# EAGLE design centerplates (EAGLE 5.07)
GROUP: openmulticopter.org; LICENSE: CC-BY-SA 3.0; PROJECT_NAME: omc centerplates; REV: v0.1
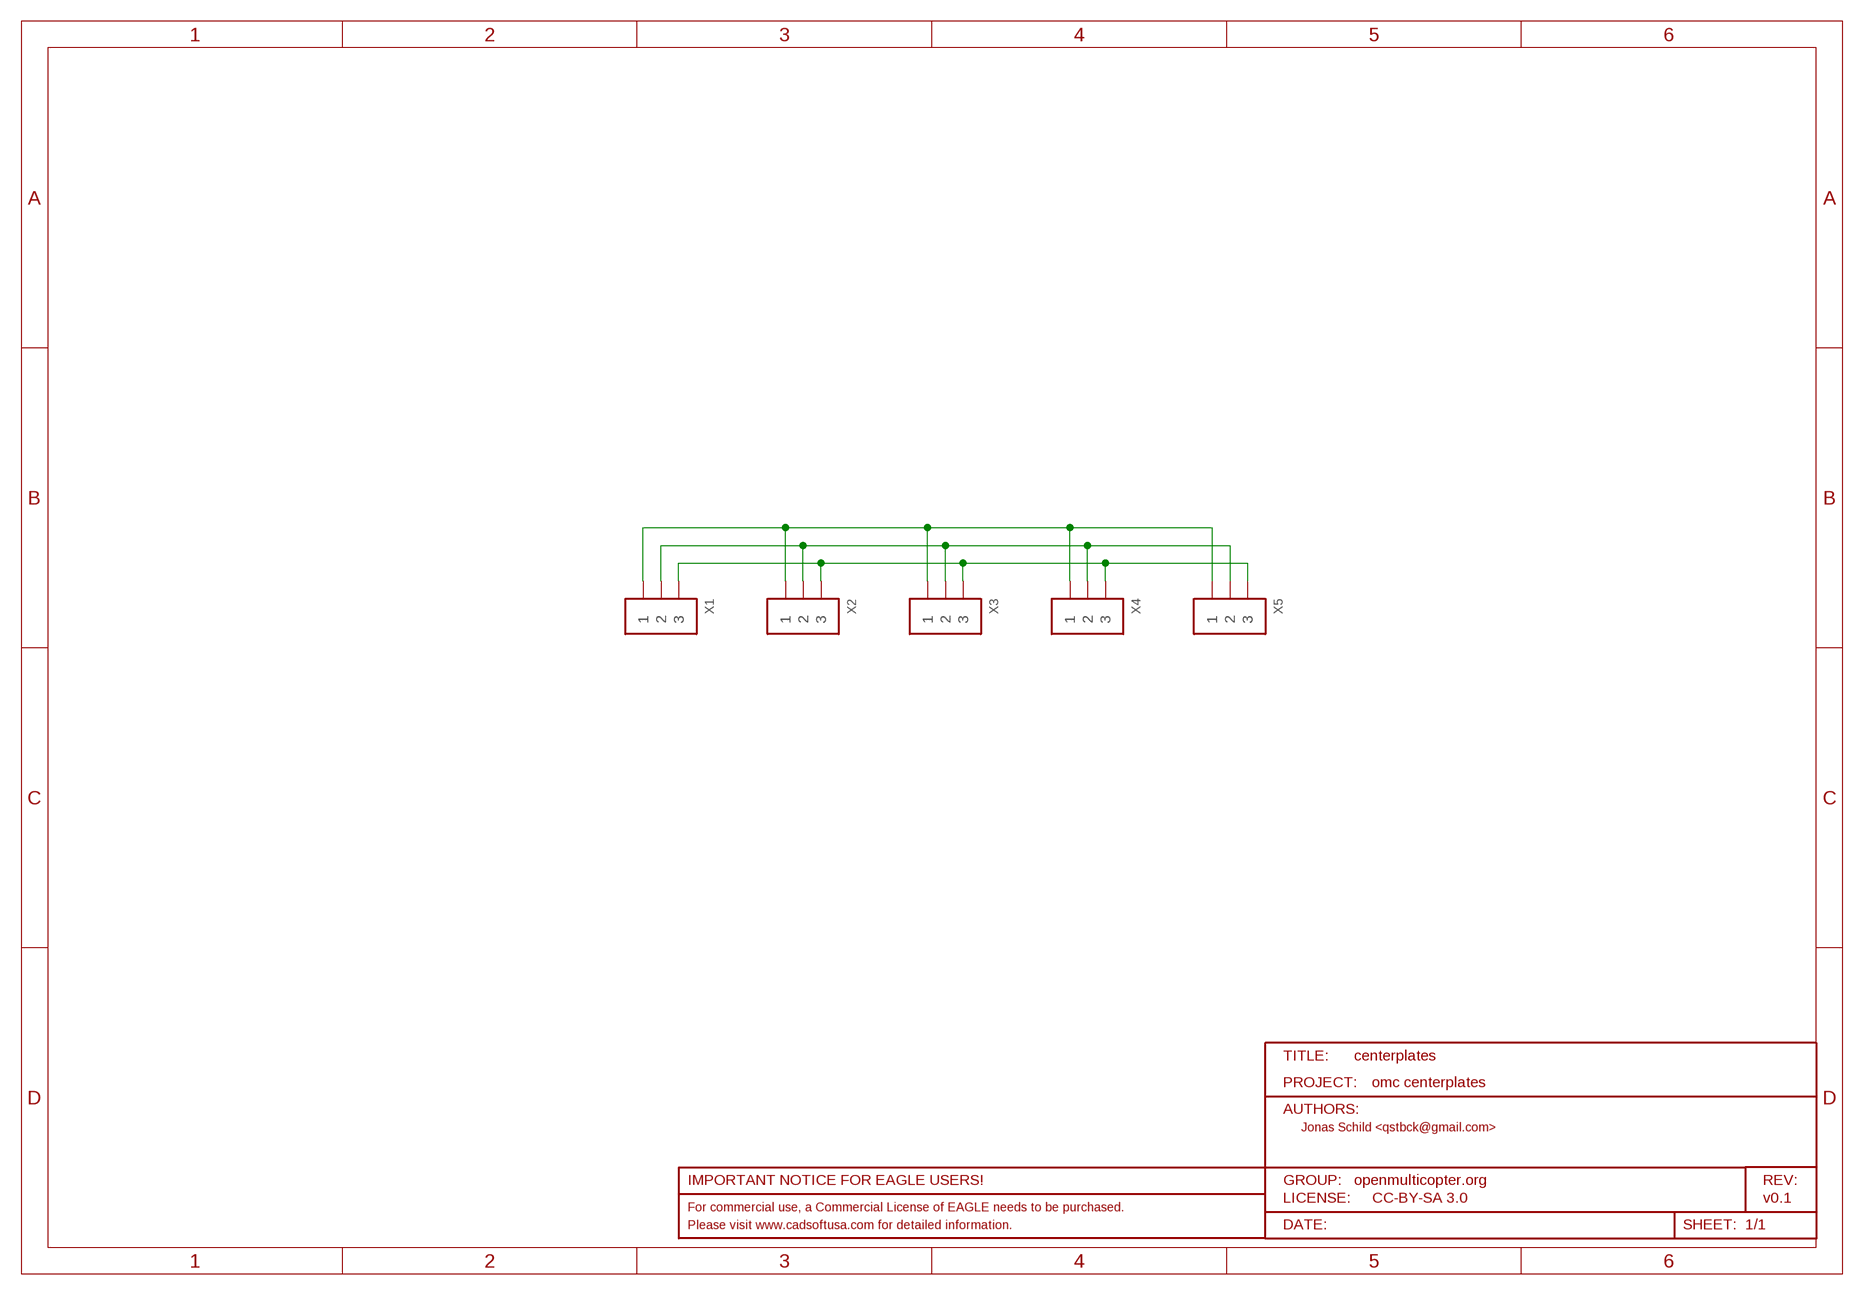
[diagram p0: schematic, sheet 1]

## Parts
X1  CONN_3-1-53261  [PB-53261-03]
X2  CONN_3-1-53261  [PB-53261-03]
X3  CONN_3-1-53261  [PB-53261-03]
X4  CONN_3-1-53261  [PB-53261-03]
X5  CONN_3-1-53261  [PB-53261-03]

## Nets
N$1: X1.1 X2.1 X3.1 X4.1 X5.1
N$2: X1.2 X2.2 X3.2 X4.2 X5.2
N$3: X1.3 X2.3 X3.3 X4.3 X5.3

## Notes on the sheet
- centerplates
- Jonas Schild <qstbck@gmail.com>

## Library data of the parts
X1-X5 = pel_molex:CONN_3-1

## Board
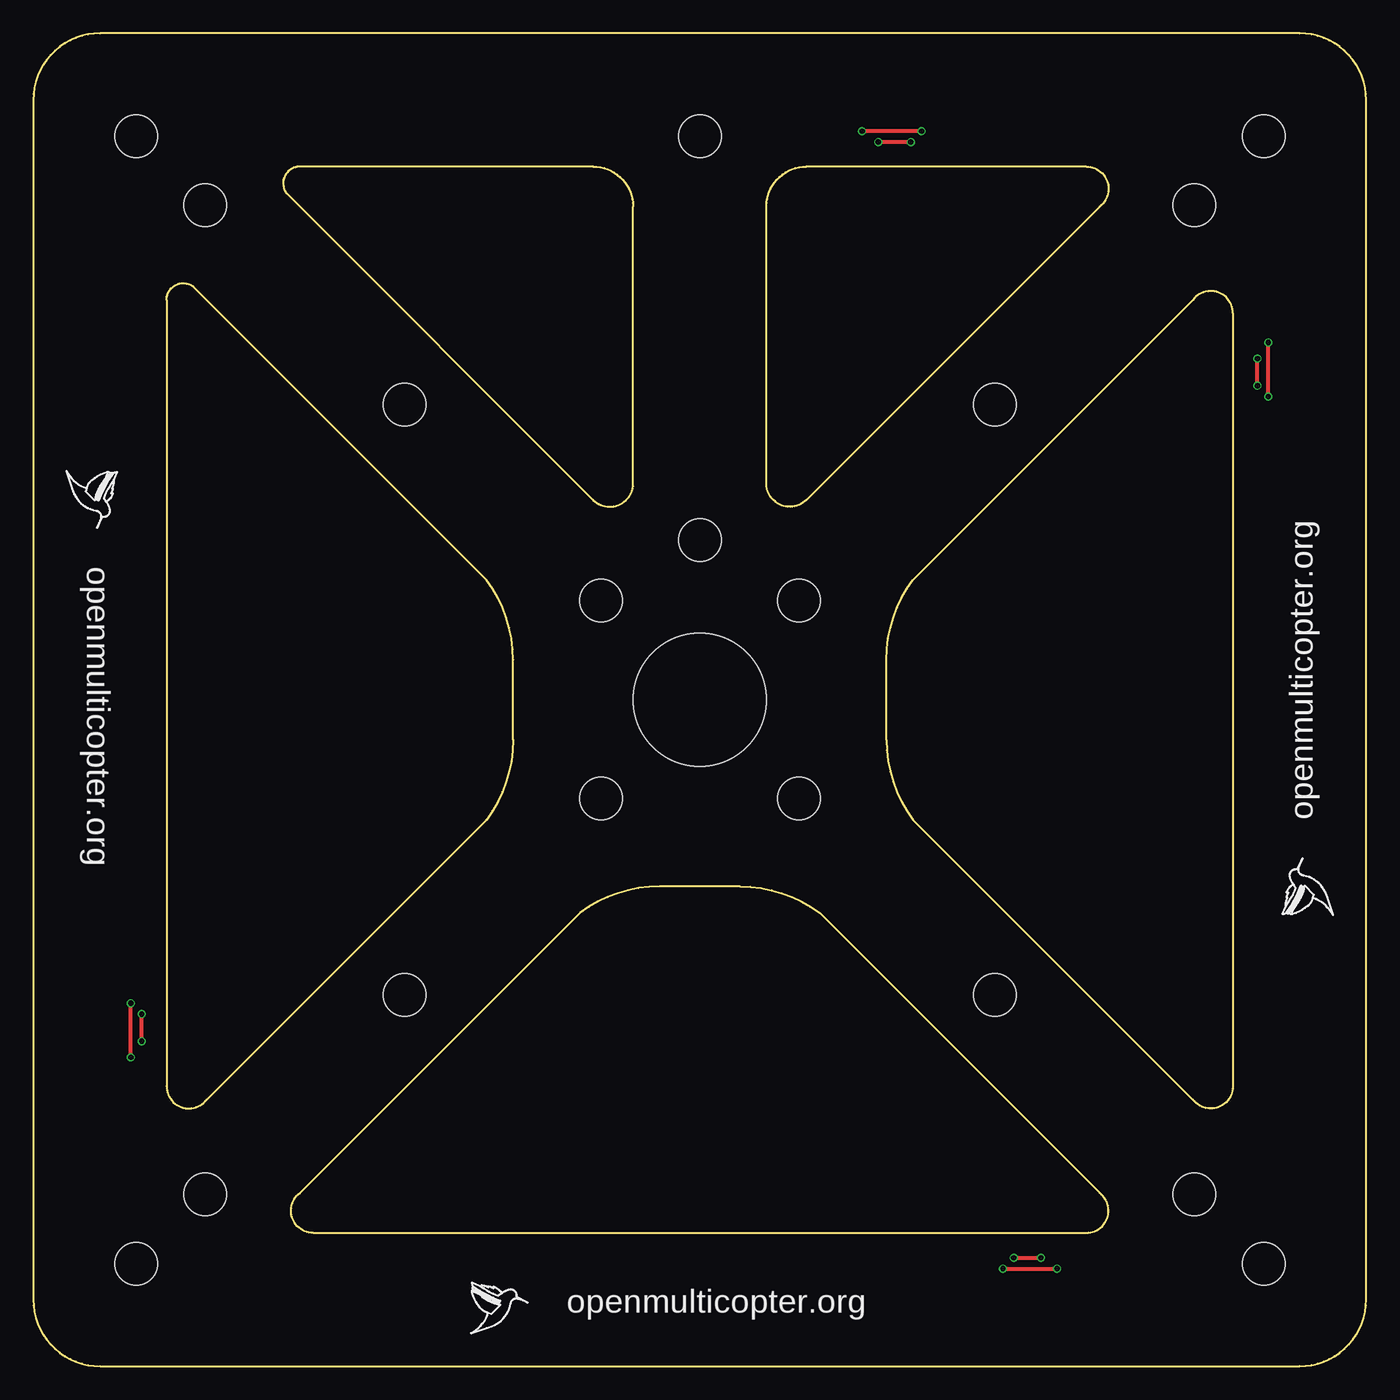
[diagram p1: board, top side]
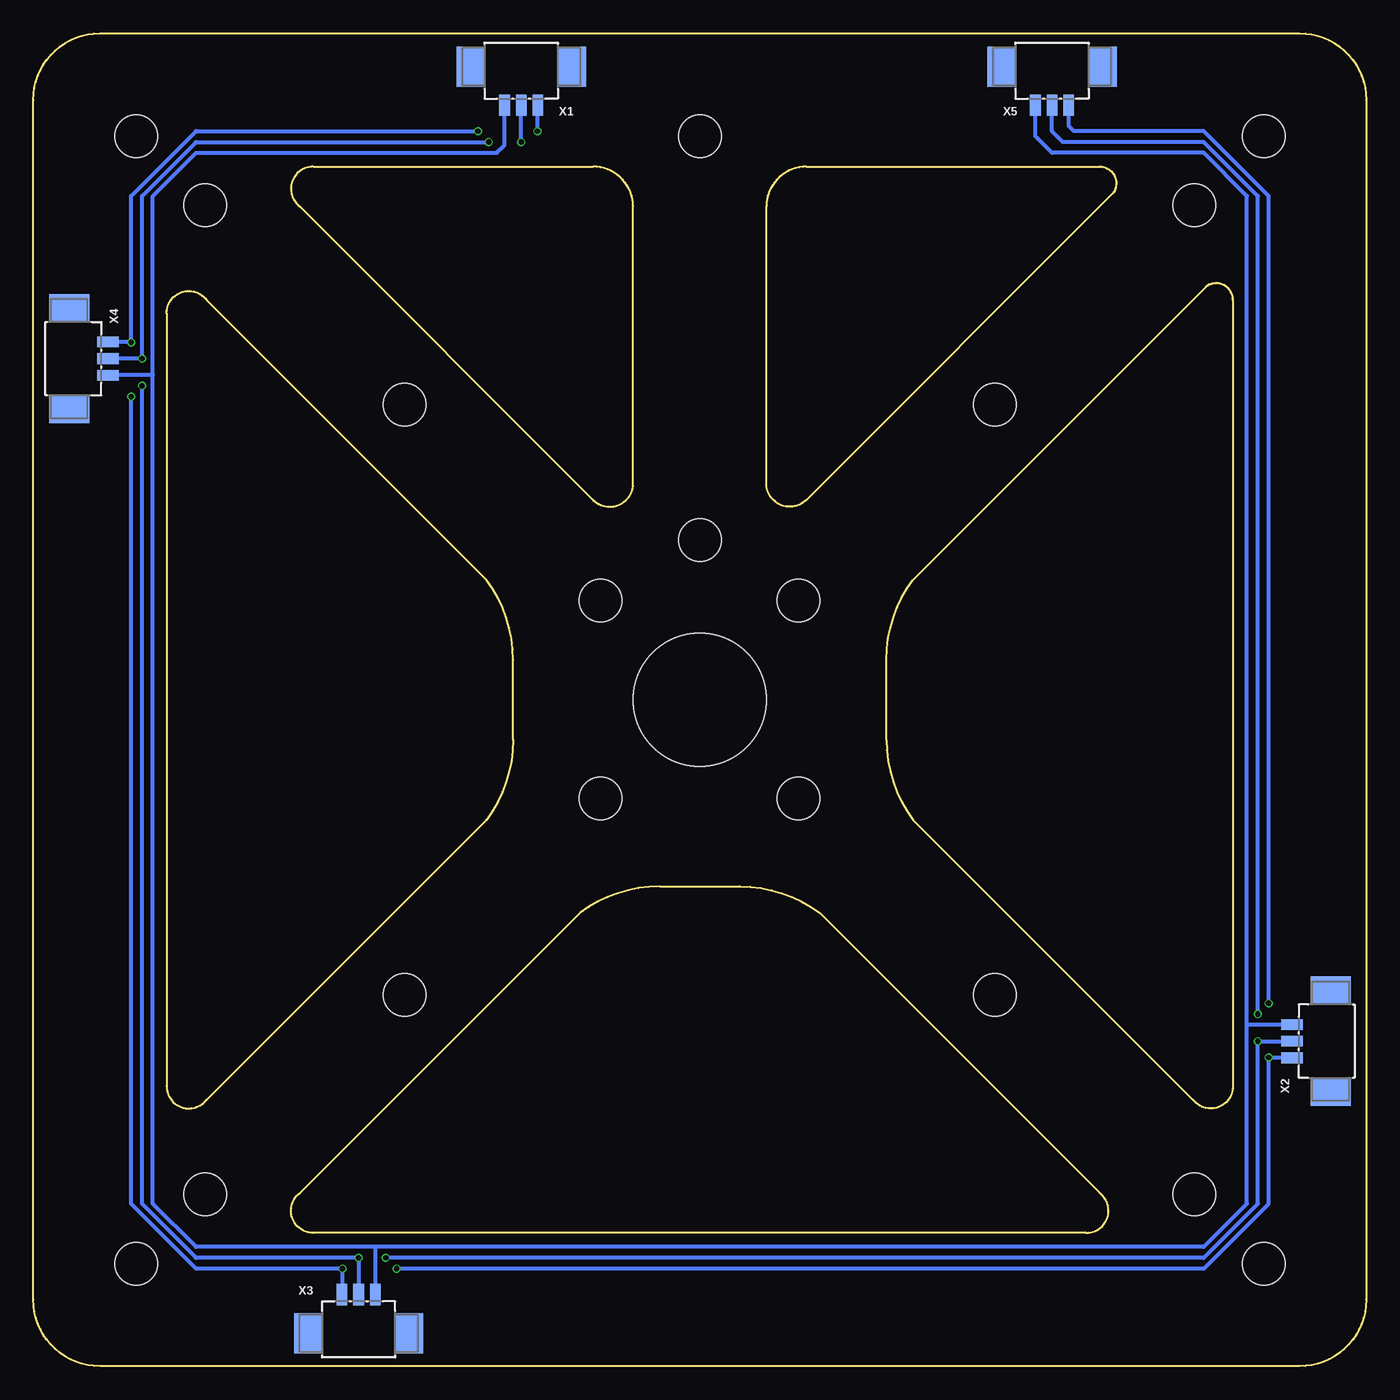
[diagram p2: board, bottom side, seen from below]

Size 100 x 100 mm. Coordinates in mm from the lower left corner, seen from the top.
Outline: 0,5 arc90 5,0 95,0 arc90 100,5 100,95 arc90 95,100 5,100 arc90 0,95 0,5
Outline: 66,59 87,80 arc-143 90,79 90,21 arc-143 87,20 66,41 arc-37 64,47 64,53 arc-37 66,59
Outline: 79,90 arc-143 80,87 58,65 arc-127 55,66 55,87 arc-90 58,90 79,90
Outline: 79,10 arc143 80,13 59,34 arc37 53,36 47,36 arc37 41,34 20,13 arc143 21,10 79,10
Outline: 10,21 arc143 13,20 34,41 arc37 36,47 36,53 arc37 34,59 12,81 arc127 10,80 10,21
Outline: 20,90 arc127 19,88 42,65 arc127 45,66 45,87 arc90 42,90 20,90
Copper layers (1*2*15*16): Top 0.035mm / dielectric 1.5mm / Route2 0.035mm / dielectric 0.15mm / Route15 0.035mm / dielectric 0.2mm / Bottom 0.035mm
Design rules "pcbCart-4Layer": minimum track width 8mil, minimum drill 0.4mm, track to track 8mil, track to pad 8mil, pad to pad 8mil, via to via 8mil, smd to smd 4mil, copper to edge 8mil, drill to drill 8mil, minimum pad ring 0.1mm, minimum via ring 0.1mm, stop-mask expansion 3mil, vias tented up to drill 0.4mm, thermal gap 8mil
Holes 3.2 mm at 7.7,7.7 92.3,7.7 92.3,92.3 7.7,92.3 27.85,27.85 27.86,72.15 72.15,27.85 72.15,72.15 12.9,12.9 87.1,87.1 12.9,87.1 87.1,12.9 42.58,42.58 42.58,57.43 57.43,57.43 57.43,42.58 50,92.3 50,62
Holes 10 mm at 50,50

### Footprints (pad centres in the part's own frame; a part is rotated, then mirrored left to right if it is on the bottom)
PB-53261-03 = smd 0.8 x 1.6: 1 -1.25,1.1; 2 0,1.1; 3 1.25,1.1 | smd 2.1 x 3: MNT1 -3.8,-1.8; MNT2 3.8,-1.8

### Placement (x,y rotation side)
E$1  [OMC-LOGO-6MIL-SILKSCREEN-2]  35,4 0 top
E$2  [OMC-LOGO-6MIL-SILKSCREEN-2]  96,36 90 top
E$3  [OMC-LOGO-6MIL-SILKSCREEN-2]  4,65 270 top
X1  63.4,95.71 180 bottom
X2  4.47,24.38 90 bottom
X3  75.59,4.27 0 bottom
X4  95.5,75.59 270 bottom
X5  23.57,95.71 180 bottom

### Tracks (layer width: path | path; a pad name or v marks a point on that pad's centre or on a via)
N$1  (via drill 0.4)
  Top 0.305: v66.65,92.66 v62.18,92.66 | v92.66,72.75 v92.66,76.81 | v72.75,7.32 v76.81,7.32 | v7.32,23.16 v7.32,27.23
  Bottom 0.305: 62.18,94.64 X1.1 62.18,94.58 v62.18,92.66 | v66.65,92.66 87.78,92.66 92.66,87.78 v92.66,76.81 92.69,76.84 X4.1 | v92.66,72.75 92.66,12.19 87.78,7.32 v76.81,7.32 76.84,7.28 X3.1 | v72.75,7.32 12.19,7.32 7.32,12.19 v7.32,23.16 5.6,23.16 X2.1 | X5.1 22.32,93.03 21.95,92.66 12.19,92.66 7.32,87.78 v7.32,27.23
N$2  (via drill 0.4)
  Top 0.305: v65.84,91.85 v63.4,91.85 | v91.85,73.56 v91.85,75.59 | v73.56,8.13 v75.59,8.13 | v8.13,24.38 v8.13,26.42
  Bottom 0.305: v63.4,91.85 X1.2 | v65.84,91.85 87.78,91.85 91.85,87.78 v91.85,75.59 X4.2 | v91.85,73.56 91.85,12.19 87.78,8.13 v75.59,8.13 X3.2 | X2.2 v8.13,24.38 8.13,12.19 12.19,8.13 v73.56,8.13 | X5.2 23.57,92.66 22.76,91.85 12.19,91.85 8.13,87.78 v8.13,26.42
N$3
  Bottom 0.305: 24.79,94.58 X5.3 24.82,92.28 23.57,91.03 12.19,91.03 8.94,87.78 8.94,25.66 8.91,25.63 | 91.03,74.37 91.03,12.19 87.78,8.94 74.37,8.94 74.34,8.91 | 91.03,74.37 91.03,87.78 87.78,91.03 65.23,91.03 64.65,91.61 X1.3 | 74.34,8.91 X3.3 | X4.3 91.06,74.34 91.03,74.37 | 8.91,25.63 X2.3 | 8.91,25.63 8.94,25.6 8.94,12.19 12.19,8.94 74.31,8.94 74.34,8.91

### Text on the board
tPlace: openmulticopter.org | openmulticopter.org | openmulticopter.org